# EAGLE design EN715_ExpansionBoard_ver1_0 (EAGLE 9.6.2)
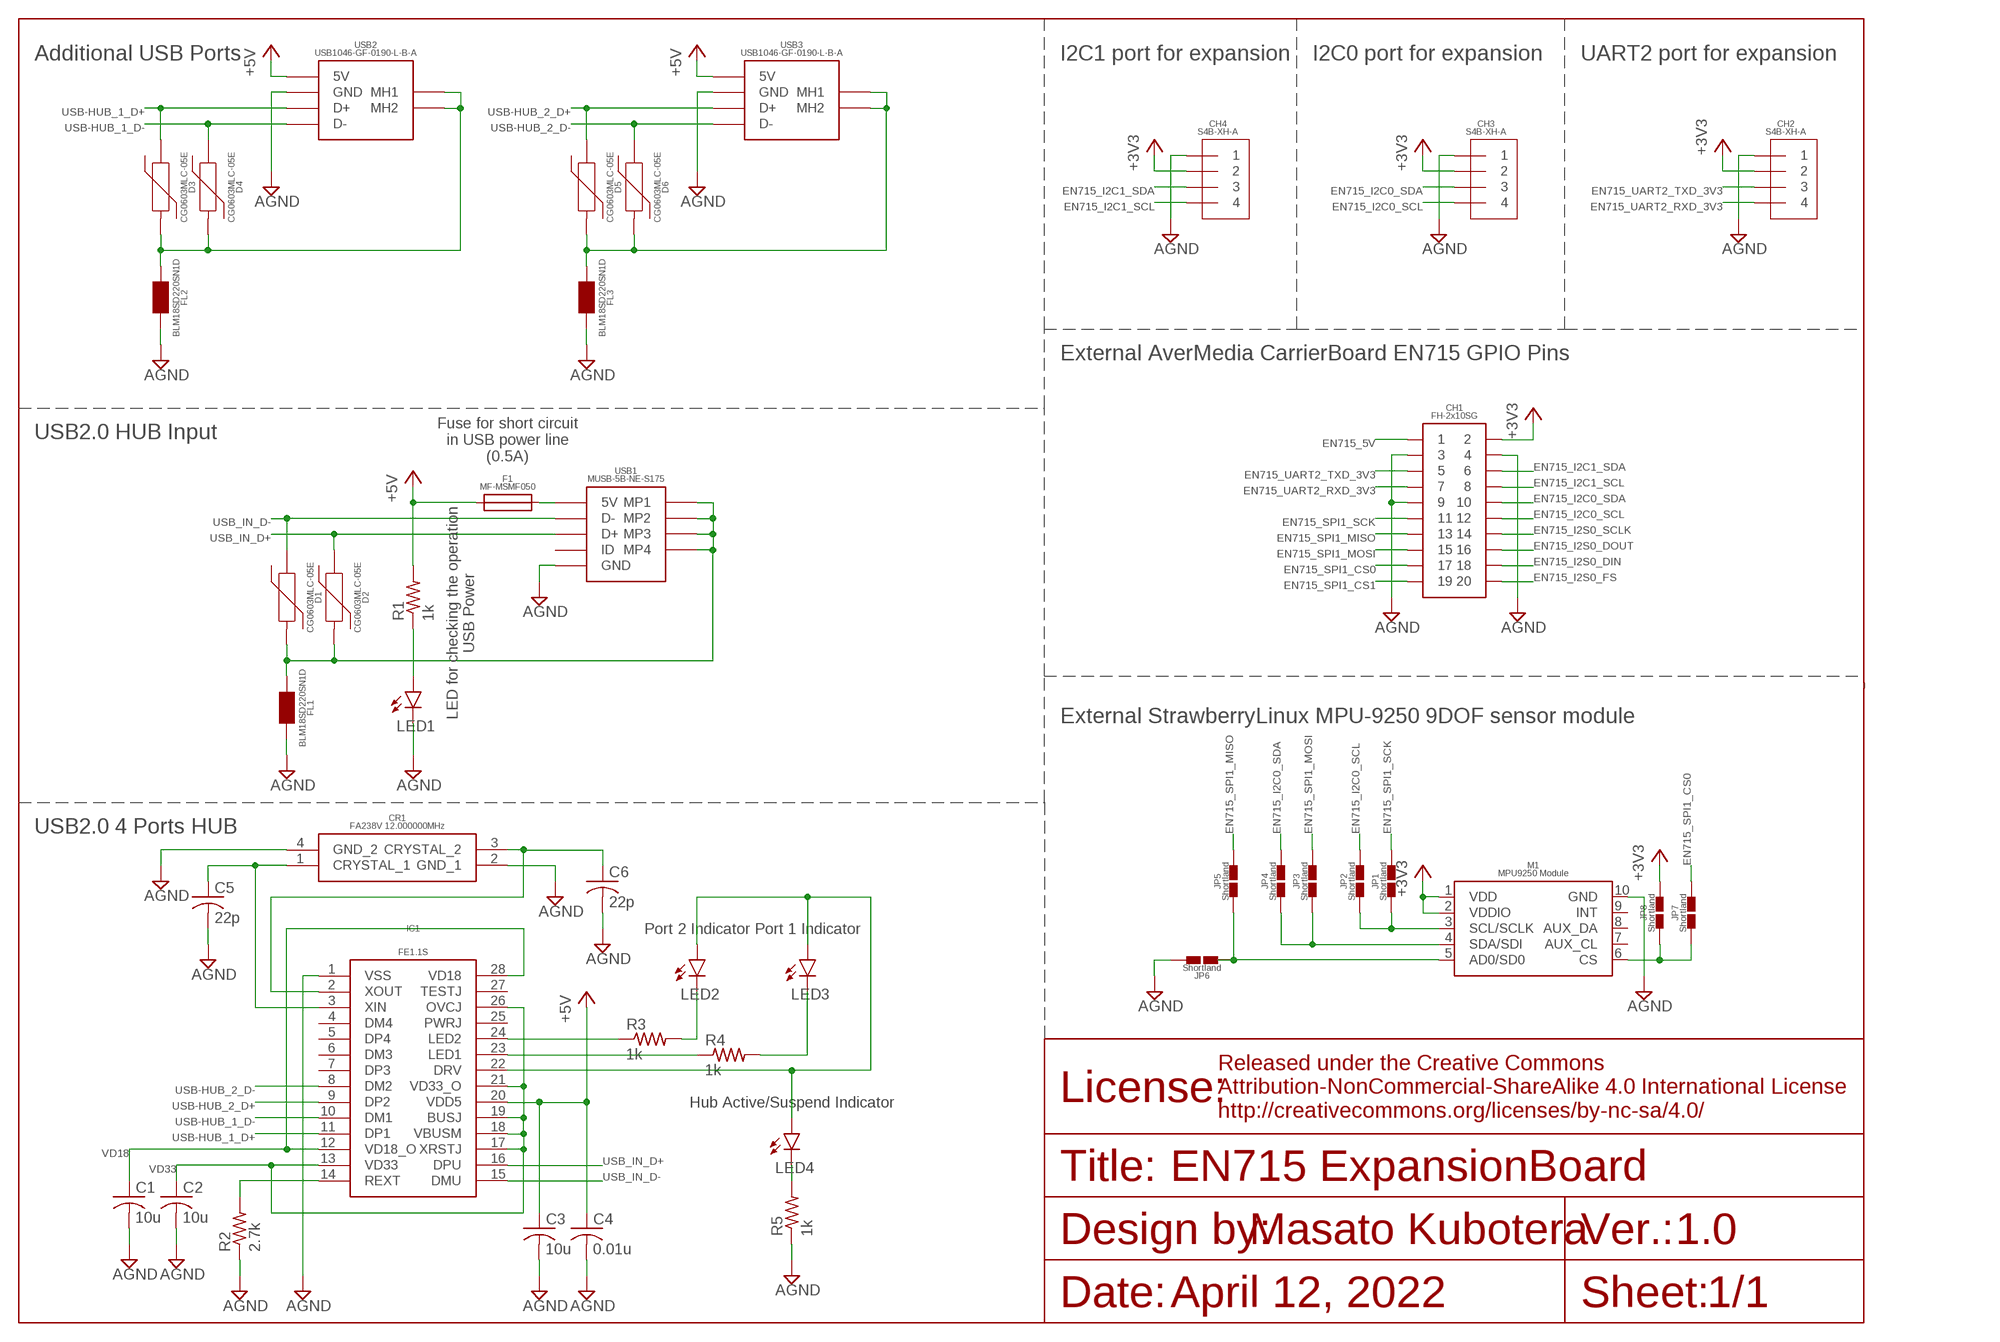
[diagram p0: schematic, sheet 1]

## Parts
C1  10u  C-USC0603  [C0603]
C2  10u  C-USC0603  [C0603]
C3  10u  C-USC0603  [C0603]
C4  0.01u  C-USC0603  [C0603]
C5  22p  C-USC0603  [C0603]
C6  22p  C-USC0603  [C0603]
CH1  2X10  [2X10]
CH2  S4B-XH-A  [S4B-XH-A]
CH3  S4B-XH-A  [S4B-XH-A]
CH4  S4B-XH-A  [S4B-XH-A]
CR1  FA238V_12.000000MHZ  [FA238V]
D1  CG0603MLC-05E  [CG0603MLC-05E]
D2  CG0603MLC-05E  [CG0603MLC-05E]
D3  CG0603MLC-05E  [CG0603MLC-05E]
D4  CG0603MLC-05E  [CG0603MLC-05E]
D5  CG0603MLC-05E  [CG0603MLC-05E]
D6  CG0603MLC-05E  [CG0603MLC-05E]
F1  MF-MSMF050  [MF-MSMF050]
FL1  BLM18SD220SN1D  [BLM18SD220SN1D]
FL2  BLM18SD220SN1D  [BLM18SD220SN1D]
FL3  BLM18SD220SN1D  [BLM18SD220SN1D]
IC1  FE1.1S  [FE1.1S]
JP1  SHORTLAND  [SHORTLAND]
JP2  SHORTLAND  [SHORTLAND]
JP3  SHORTLAND  [SHORTLAND]
JP4  SHORTLAND  [SHORTLAND]
JP5  SHORTLAND  [SHORTLAND]
JP6  SHORTLAND  [SHORTLAND]
JP7  SHORTLAND  [SHORTLAND]
JP8  SHORTLAND  [SHORTLAND]
LED1  LEDSML0603  [SML0603]
LED2  LEDSML0603  [SML0603]
LED3  LEDSML0603  [SML0603]
LED4  LEDSML0603  [SML0603]
M1  MPU9250_MODULE  [MPU9250_MODULE]
R1  1k  R-US_R0603  [R0603]
R2  2.7k  R-US_R0603  [R0603]
R3  1k  R-US_R0603  [R0603]
R4  1k  R-US_R0603  [R0603]
R5  1k  R-US_R0603  [R0603]
USB1  MINI_USB_B_SMD  [MINI_USB_B_SMD]
USB2  USB_A_X1_SMD  [USB_A_X1_SMD]
USB3  USB_A_X1_SMD  [USB_A_X1_SMD]

## Nets
+3V3 [USB-Power]: CH1.2 CH2.2 CH3.2 CH4.2 JP8.2 M1.1(VDD) M1.2(VDDIO)
+5V [USB-Power]: C3.1 C4.1 F1.1 IC1.20(VDD5) R1.2 USB2.1(5V) USB3.1(5V)
AGND [USB-Power]: C1.2 C2.2 C3.2 C4.2 C5.2 C6.2 CH1.3 CH1.4 CH1.9 CH2.1 CH3.1 CH4.1 CR1.2(GND_1) CR1.4(GND_2) FL1.2 FL2.2 FL3.2 IC1.1(VSS) JP6.2 LED1.C M1.10(GND) R2.1 R5.1 USB1.5(GND) USB2.4(GND) USB3.4(GND)
B_FUSE_USB_MINI_B [USB-Power]: F1.2 USB1.1(5V)
EN715_5V [USB-Power]: CH1.1
EN715_I2C0_SCL [USB-Data]: CH1.12 CH3.4 JP2.2
EN715_I2C0_SDA [USB-Data]: CH1.10 CH3.3 JP4.2
EN715_I2C1_SCL [USB-Data]: CH1.8 CH4.4
EN715_I2C1_SDA [USB-Data]: CH1.6 CH4.3
EN715_I2S0_DIN [USB-Data]: CH1.18
EN715_I2S0_DOUT [USB-Data]: CH1.16
EN715_I2S0_FS [USB-Data]: CH1.20
EN715_I2S0_SCLK [USB-Data]: CH1.14
EN715_SPI1_CS0 [USB-Data]: CH1.17 JP7.2
EN715_SPI1_CS1 [USB-Data]: CH1.19
EN715_SPI1_MISO [USB-Data]: CH1.13 JP5.2
EN715_SPI1_MOSI [USB-Data]: CH1.15 JP3.2
EN715_SPI1_SCK [USB-Data]: CH1.11 JP1.2
EN715_UART2_RXD_3V3 [USB-Data]: CH1.7 CH2.4
EN715_UART2_TXD_3V3 [USB-Data]: CH1.5 CH2.3
FE1.1S_DRV [USB-Power]: IC1.22(DRV) LED2.A LED3.A LED4.A
FE1.1S_DRV_LED_A [USB-Power]: LED4.C R5.2
FE1.1S_LED1_A [USB-Power]: LED3.C R4.2
FE1.1S_LED_1_B [USB-Power]: IC1.23(LED1) R4.1
FE1.1S_LED_2_A [USB-Power]: LED2.C R3.2
FE1.1S_LED_2_B [USB-Power]: IC1.24(LED2) R3.1
LED_USBIN [USB-Power]: LED1.A R1.1
MPU9250_AD0/SD0: JP5.1 JP6.1 M1.5(AD0/SD0)
MPU9250_CS: JP7.1 JP8.1 M1.6(CS)
MPU9250_SCL/SCLK: JP1.1 JP2.1 M1.3(SCL/SCLK)
MPU9250_SDA/SDI: JP3.1 JP4.1 M1.4(SDA/SDI)
REXT_FE1.1S [USB-Data]: IC1.14(REXT) R2.2
USB-HUB_1_D+ [USB-Data]: D3.1 IC1.11(DP1) USB2.3(D+)
USB-HUB_1_D- [USB-Data]: D4.1 IC1.10(DM1) USB2.2(D-)
USB-HUB_2_D+ [USB-Data]: D5.1 IC1.9(DP2) USB3.3(D+)
USB-HUB_2_D- [USB-Data]: D6.1 IC1.8(DM2) USB3.2(D-)
USB_A_1_SHIELD [USB-Power]: D3.2 D4.2 FL2.1 USB2.MH1 USB2.MH2
USB_A_2_SHIELD [USB-Power]: D5.2 D6.2 FL3.1 USB3.MH1 USB3.MH2
USB_IN_D+ [USB-Data]: D2.1 IC1.16(DPU) USB1.3(D+)
USB_IN_D- [USB-Data]: D1.1 IC1.15(DMU) USB1.2(D-)
USB_MINI_B_SHIELD [USB-Power]: D1.2 D2.2 FL1.1 USB1.MP1 USB1.MP2 USB1.MP3 USB1.MP4
VD18 [USB-Power]: C1.1 IC1.12(VD18_O) IC1.28(VD18)
VD33 [USB-Power]: C2.1 IC1.13(VD33) IC1.17(XRSTJ) IC1.18(VBUSM) IC1.19(BUSJ) IC1.21(VD33_O) IC1.26(OVCJ)
XIN_FE1.1S [USB-Data]: C5.1 CR1.1(CRYSTAL_1) IC1.3(XIN)
XOUT_FE1.1S [USB-Data]: C6.1 CR1.3(CRYSTAL_2) IC1.2(XOUT)
Unconnected: IC1.4(DM4) IC1.5(DP4) IC1.6(DM3) IC1.7(DP3) IC1.25(PWRJ) IC1.27(TESTJ) M1.7(AUX_CL) M1.8(AUX_DA) M1.9(INT) USB1.4(ID)

## Notes on the sheet
- Additional USB Ports | I2C1 port for expansion | I2C0 port for expansion | UART2 port for expansion
- External AverMedia CarrierBoard EN715 GPIO Pins
- USB2.0 HUB Input
- Fuse for short circuit
  in USB power line
  (0.5A)
- LED for checking the operation
  USB Power
- External StrawberryLinux MPU-9250 9DOF sensor module
- USB2.0 4 Ports HUB
- Port 2 Indicator | Port 1 Indicator
- Hub Active/Suspend Indicator
- EN715 ExpansionBoard
- 1.0
- April 12, 2022 | 1/1

## Library data of the parts
C1-C6 = rcl:C-US: CAPACITOR, American symbol; SPICEPREFIX: C
CH1 = Pin_socket:2X10
CH2-CH4 = JST-XH:S4B-XH-A
CR1 = FA238V:FA238V_12.000000MHZ
D1-D6 = CG0603MLC-05E:CG0603MLC-05E
F1 = MF-MSMF:MF-MSMF050
FL1-FL3 = BLM18SD220SN1D:BLM18SD220SN1D
IC1 = FE1.1S:FE1.1S
JP1-JP8 = Shortland:SHORTLAND
LED1-LED4 = led:LED: LED OSRAM: - CHIPLED LG R971, LG N971, LY N971, LG Q971, LY Q971, LO R971, LY R971 LH N974, LH R974 LS Q976, LO Q976, LY Q976 LO Q996 - Hyper CHIPLED LW Q18S LB Q993, LB Q99A, LB R99A - SideLED LS A670, LO A670, LY A670, LG A670, LP A670 LB A673, LV A673, LT A673, LW A673 LH A674 LY A675 LS A676, LA A676, LO A676, LY A676, LW A676 LS A679, LY A679, LG A679 - Hyper Micro SIDELED® LS Y876, LA Y876, LO Y876, LY Y876 LT Y87S - SmartLED LW L88C, LW L88S LB L89C, LB L89S, LG L890 LS L89K, LO L89K, LY L89K LS L896, LA L896, LO L896, LY L896 - TOPLED LS T670, LO T670, LY T670, LG T670, LP T670 LSG T670, LSP T670, LSY T670, LOP T670, LYG T670 LG T671, LOG T671, LSG T671 LB T673, LV T673, LT T673, LW T673 LH T674 LS T676, LA T676, LO T676, LY T676, LB T676, LH T676, LSB T676, LW T676 LB T67C, LV T67C, LT T67C, LS T67K, LO T67K, LY T67K, LW E67C LS E67B, LA E67B, LO E67B, LY E67B, LB E67C, LV E67C, LT E67C LW T67C LS T679, LY T679, LG T679 LS T770, LO T770, LY T770, LG T770, LP T770 LB T773, LV T773, LT T773, LW T773 LH T774 LS E675, LA E675, LY E675, LS T675 LS T776, LA T776, LO T776, LY T776, LB T776 LHGB T686 LT T68C, LB T68C - Hyper Mini TOPLED® LB M676 - Mini TOPLED Santana® LG M470 LS M47K, LO M47K, LY M47K Source: http://www.osram.convergy.de LUXEON: - LUMILED® LXK2-PW12-R00, LXK2-PW12-S00, LXK2-PW14-U00, LXK2-PW14-V00 LXK2-PM12-R00, LXK2-PM12-S00, LXK2-PM14-U00 LXK2-PE12-Q00, LXK2-PE12-R00, LXK2-PE12-S00, LXK2-PE14-T00, LXK2-PE14-U00 LXK2-PB12-K00, LXK2-PB12-L00, LXK2-PB12-M00, LXK2-PB14-N00, LXK2-PB14-P00, LXK2-PB14-Q00 LXK2-PR12-L00, LXK2-PR12-M00, LXK2-PR14-Q00, LXK2-PR14-R00 LXK2-PD12-Q00, LXK2-PD12-R00, LXK2-PD12-S00 LXK2-PH12-R00, LXK2-PH12-S00 LXK2-PL12-P00, LXK2-PL12-Q00, LXK2-PL12-R00 Source: www.luxeon.com KINGBRIGHT: KA-3528ASYC Source: www.kingbright.com
M1 = Strawberry-Linux_MPUP250_Module:MPU9250_MODULE
R1-R5 = rcl:R-US_: RESISTOR, American symbol; SPICEPREFIX: R
USB1 = USB_Connector:MINI_USB_B_SMD
USB2 USB3 = USB_Connector:USB_A_X1_SMD

## Net classes
1 USB-Data: width 0.203 mm, drill 0.127 mm, clearance 0.203 mm
2 USB-Power: width 0.254 mm, drill 0.127 mm, clearance 0.203 mm

## Board
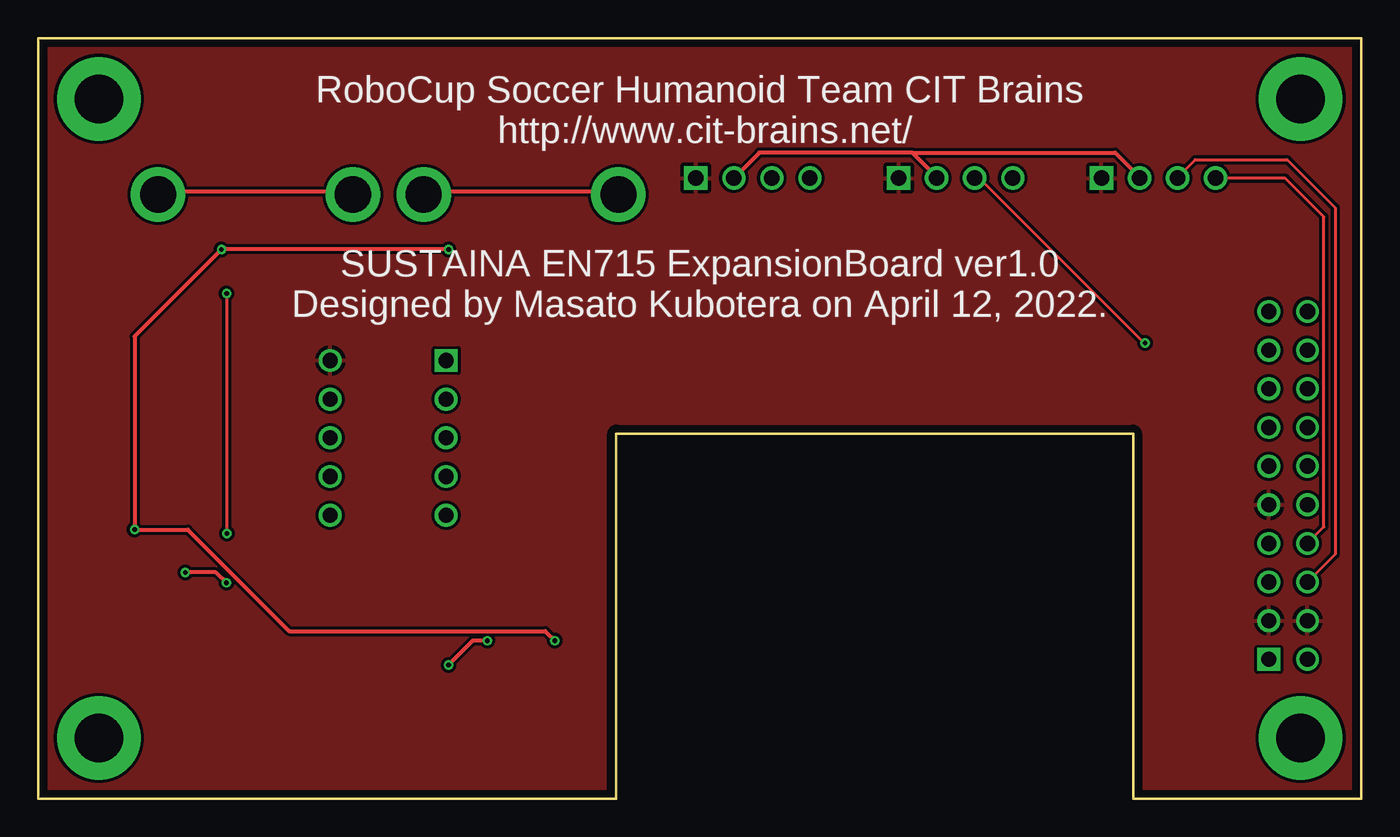
[diagram p1: board, top side]
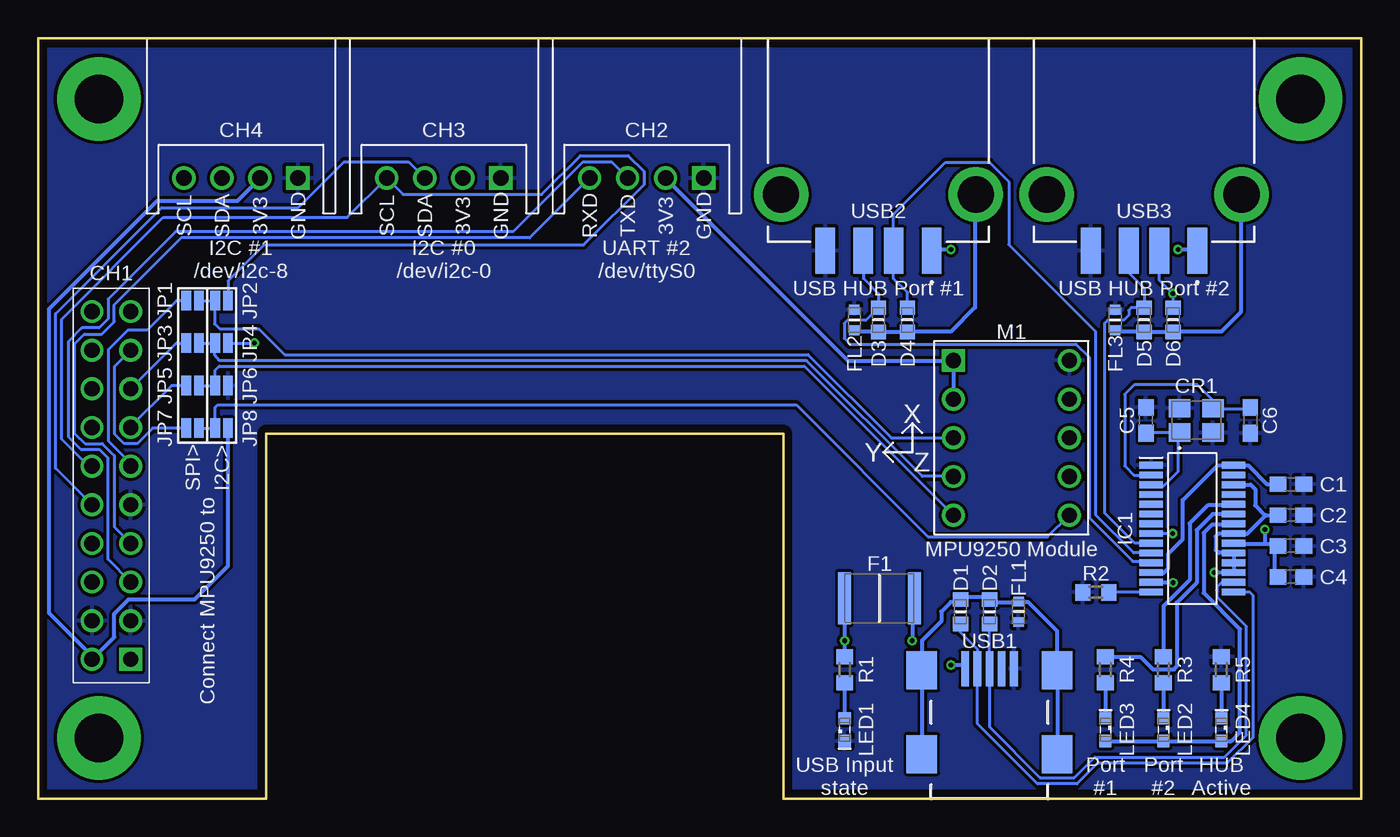
[diagram p2: board, bottom side, seen from below]

Size 87 x 50 mm. Coordinates in mm from the lower left corner, seen from the top.
Outline: 0,50 0,0 38,0 38,24 72,24 72,0 87,0 87,50 0,50
Copper layers (1*16): Top 0.035mm / dielectric 1.6mm / Bottom 0.035mm
Design rules "Elecrow_2-layer_PCB_eagle_rule": minimum track width 6mil, minimum drill 12mil, track to track 6mil, track to pad 6mil, pad to pad 6mil, via to via 8mil, smd to smd 0mil, copper to edge 20mil, drill to drill 10mil, minimum pad ring 6mil, minimum via ring 6mil, stop-mask expansion 0mil, vias tented up to drill 100mil, thermal gap 10mil

### Footprints (pad centres in the part's own frame; a part is rotated, then mirrored left to right if it is on the bottom)
C0603 = smd 1.1 x 1: 1 -0.85,0; 2 0.85,0
2X10 = drill 1 pad 1.5 square: 1 -11.43,-1.27 | drill 1 pad 1.5: 2 -11.43,1.27; 3 -8.89,-1.27; 4 -8.89,1.27; 5 -6.35,-1.27; 6 -6.35,1.27; 7 -3.81,-1.27; 8 -3.81,1.27; 9 -1.27,-1.27; 10 -1.27,1.27; 11 1.27,-1.27; 12 1.27,1.27; 13 3.81,-1.27; 14 3.81,1.27; 15 6.35,-1.27; 16 6.35,1.27; 17 8.89,-1.27; 18 8.89,1.27; 19 11.43,-1.27; 20 11.43,1.27
S4B-XH-A = drill 1.016 square: 1 3.75,0 | drill 1.016: 2 1.25,0; 3 -1.25,0; 4 -3.75,0
FA238V = smd 1.4 x 1.2: 1 -1.1,-0.8; 2 1.1,-0.8; 3 1.1,0.8; 4 -1.1,0.8
CG0603MLC-05E = smd 0.95 x 1: 1 -0.8,0; 2 0.8,0
MF-MSMF050 = smd 0.85 x 3.43: 1 -2.3,0; 2 2.3,0
BLM18SD220SN1D = smd 0.65 x 0.7: 1 -0.675,0; 2 0.675,0
FE1.1S = smd 1.525 x 0.44: 1 -2.712,4.16; 2 -2.712,3.52; 3 -2.712,2.88; 4 -2.712,2.24; 5 -2.712,1.6; 6 -2.712,0.96; 7 -2.712,0.32; 8 -2.712,-0.32; 9 -2.712,-0.96; 10 -2.712,-1.6; 11 -2.712,-2.24; 12 -2.712,-2.88; 13 -2.712,-3.52; 14 -2.712,-4.16; 15 2.712,-4.16; 16 2.712,-3.52; 17 2.712,-2.88; 18 2.712,-2.24; 19 2.712,-1.6; 20 2.712,-0.96; 21 2.712,-0.32; 22 2.712,0.32; 23 2.712,0.96; 24 2.712,1.6; 25 2.712,2.24; 26 2.712,2.88; 27 2.712,3.52; 28 2.712,4.16
SHORTLAND = smd 0.635 x 1.27: 1 -0.419,0; 2 0.419,0
SML0603 = smd 0.8 x 0.8: A 0.75,0; C -0.75,0
MPU9250_MODULE = drill 1 square: 1 -5.08,-3.81 | drill 1: 2 -2.54,-3.81; 3 0,-3.81; 4 2.54,-3.81; 5 5.08,-3.81; 6 5.08,3.81; 7 2.54,3.81; 8 0,3.81; 9 -2.54,3.81; 10 -5.08,3.81
R0603 = smd 1 x 1.1: 1 -0.85,0; 2 0.85,0
MINI_USB_B_SMD = smd 0.5 x 2.3: 1 -1.6,8.55; 2 -0.8,8.55; 3 0,8.55; 4 0.8,8.55; 5 1.6,8.55 | smd 2 x 2.5: MP1 -4.45,8.45; MP2 4.45,8.45; MP3 4.45,2.95; MP4 -4.45,2.95
USB_A_X1_SMD = smd 1.3 x 3: 1 -3.5,13.98; 2 -1,13.98; 3 1,13.98; 4 3.5,13.98 | drill 2.38 pad 3.57: MH1 -6.4,10.28; MH2 6.4,10.28

### Placement (x,y rotation side)
C1  4.64,20.68 0 bottom
C2  4.64,18.65 0 bottom
C3  4.64,16.62 0 bottom
C4  4.64,14.59 0 bottom
C5  14.16,24.87 90 bottom
C6  7.3,24.87 270 bottom
CH1  82.18,20.6 90 bottom
CH2  46.99,40.8 0 bottom
CH3  60.33,40.8 0 bottom
CH4  73.66,40.8 0 bottom
CR1  10.86,24.87 0 bottom
D1  26.36,12.3 90 bottom
D2  24.45,12.3 90 bottom
D3  31.75,31.48 270 bottom
D4  29.85,31.48 270 bottom
D5  14.29,31.48 270 bottom
D6  12.39,31.48 270 bottom
F1  31.69,13.19 0 bottom
FL1  22.55,12.3 270 bottom
FL2  33.34,31.48 90 bottom
FL3  16.2,31.48 90 bottom
IC1  11.12,17.76 0 bottom
JP1  76.84,32.75 180 bottom
JP2  74.93,32.75 0 bottom
JP3  76.84,29.95 180 bottom
JP4  74.93,29.95 0 bottom
JP5  76.84,27.16 180 bottom
JP6  74.93,27.16 0 bottom
JP7  76.84,24.36 180 bottom
JP8  74.93,24.36 0 bottom
LED1  33.98,4.55 90 bottom
LED2  13.02,4.55 270 bottom
LED3  16.83,4.55 270 bottom
LED4  9.21,4.55 270 bottom
M1  23.02,23.73 270 bottom
R1  33.98,8.49 90 bottom
R2  17.46,13.57 0 bottom
R3  13.02,8.49 270 bottom
R4  16.83,8.49 270 bottom
R5  9.21,8.49 270 bottom
USB1  24.45,0 0 bottom
USB2  31.75,50 180 bottom
USB3  14.29,50 180 bottom

### Tracks (layer width: path | path; a pad name or v marks a point on that pad's centre or on a via)
+3V3
  Top 0.254: 26.99,28.81 M1.1 | 57.47,42.46 47.41,42.46 45.75,40.8 CH2.2 | 57.47,42.46 59.06,40.88 CH3.2 | 57.47,42.46 70.81,42.46 72.39,40.88 CH4.2
  Bottom 0.254: CH4.2 73.92,39.29 79.19,39.29 86.29,32.19 86.29,12.22 83.5,9.44 CH1.2 81.99,10.63 81.99,12.16 81.04,13.11 76.72,13.11 74.53,15.3 74.53,24.35 JP8.2 | CH2.2 33.76,28.81 M1.1 M1.2
+5V  (via drill 0.3)
  Top 0.254: v26.99,36.11 v12.07,36.11 6.35,30.4 v6.35,17.7 9.84,17.7 16.51,11.03 33.34,11.03 v33.98,10.39
  Bottom 0.254: R1.2 v33.98,10.39 33.98,12.94 F1.1 | C4.1 5.72,14.84 5.72,16.43 C3.1 5.72,16.74 6.35,16.74 | 6.35,16.74 8.26,16.74 IC1.20 | v12.07,36.11 10.8,36.11 USB3.1 | v26.99,36.11 27.94,36.11 USB2.1 | v6.35,17.7 6.35,16.74
AGND
  pour Top: -0.95,51.03 -0.95,-1.04 38.42,-1.04 38.42,23.09 71.44,23.09 71.44,-1.04 87.95,-1.04 87.95,51.03
  pour Bottom: -1.59,51.67 -1.59,-1.67 39.05,-1.67 39.05,22.46 70.81,22.46 70.81,-1.67 88.59,-1.67 88.59,51.67
B_FUSE_USB_MINI_B  (via drill 0.3)
  Top 0.254: v26.99,8.81 28.58,10.39 v29.53,10.39
  Bottom 0.254: v26.99,8.81 26.04,8.81 USB1.1 | v29.53,10.39 29.53,12.94 F1.2
EN715_I2C0_SCL
  Bottom 0.203: CH1.12 83.68,21.87 85.44,23.63 85.44,31.54 78.76,38.21 66.67,38.21 CH3.4 63.01,39.73 53.89,39.73 51.35,42.27 48.21,42.27 47.18,41.24 47.18,40.36 51.13,36.41 72.15,36.41 74.51,34.04 JP2.2
EN715_I2C0_SDA  (via drill 0.3)
  Top 0.203: CH3.3 61.89,40.8 72.74,29.95 v72.77,29.95
  Bottom 0.203: CH1.10 85.84,21.72 85.84,31.89 78.88,38.86 69.9,38.86 66.89,41.87 62.64,41.87 CH3.3 | JP4.2 v72.77,29.95
EN715_I2C1_SCL
  Top 0.203: CH4.4 81.98,40.8 84.53,38.25 84.53,17.87 CH1.8
EN715_I2C1_SDA
  Top 0.203: CH4.3 74.91,40.86 76.07,42.02 82.11,42.02 85.27,38.85 85.27,16.07 CH1.6
EN715_SPI1_CS0
  Bottom 0.203: CH1.17 81.97,28.43 81.97,23.97 81.35,23.36 80.47,23.36 79.46,24.36 JP7.2
EN715_SPI1_MISO
  Bottom 0.203: JP5.2 78.23,27.16 80.91,24.48 CH1.13
EN715_SPI1_MOSI
  Bottom 0.203: CH1.15 77.91,29.95 JP3.2
EN715_SPI1_SCK
  Bottom 0.203: JP1.2 77.89,32.75 79.84,30.8 81.09,30.8 82.37,29.52 82.37,23.52 80.91,22.06 CH1.11
EN715_UART2_RXD_3V3
  Bottom 0.203: CH2.4 54.68,36.87 77.6,36.87 81.99,32.48 81.99,31.36 82.81,30.55 83.95,30.55 84.6,29.89 84.6,24.04 83.91,23.34 82.77,23.34 81.99,22.56 81.99,17.87 CH1.7
EN715_UART2_TXD_3V3
  Bottom 0.203: CH2.3 48.24,40.83 49.28,41.87 51.18,41.87 55.77,37.28 77.95,37.28 82.4,32.84 82.4,31.54 82.99,30.95 84.12,30.95 85.01,30.05 85.01,23.8 84.16,22.94 82.94,22.94 82.4,22.4 82.4,15.73 CH1.5
FE1.1S_DRV
  Bottom 0.254: LED3.A LED2.A LED4.A 8.56,3.8 7.99,4.38 7.99,11.16 10.38,13.54 10.38,17.48 9.84,18.02 8.58,18.02 IC1.22
FE1.1S_DRV_LED_A
  Bottom 0.254: R5.2 LED4.C
FE1.1S_LED1_A
  Bottom 0.254: R4.2 LED3.C
FE1.1S_LED_1_B
  Bottom 0.254: 8.58,18.65 IC1.23 9.79,18.72 10.84,17.67 10.84,14.21 12.14,12.91 12.14,8.7 12.33,8.51 13.71,8.51 14.54,9.34 R4.1
FE1.1S_LED_2_A
  Bottom 0.254: R3.2 LED2.C
FE1.1S_LED_2_B
  Bottom 0.254: IC1.24 8.48,19.29 10.11,19.29 11.29,18.1 11.29,14.4 13.02,12.67 R3.1
LED_USBIN
  Bottom 0.254: R1.1 LED1.A
MPU9250_AD0/SD0
  Bottom 0.203: JP5.1 JP6.1 75.35,28.18 75.09,28.44 36.62,28.44 M1.5
MPU9250_CS
  Bottom 0.203: JP7.1 JP8.1 75.35,25.72 75.19,25.89 37.15,25.89 28.49,17.23 20.64,17.23 M1.6
MPU9250_SCL/SCLK
  Bottom 0.203: JP1.1 JP2.1 75.39,32.71 75.39,31.22 75.06,30.89 72.48,30.89 70.79,29.2 36.37,29.2 30.9,23.73 M1.3
MPU9250_SDA/SDI
  Bottom 0.203: JP3.1 75.39,29.95 | 75.39,29.95 JP4.1 | M1.4 28.86,21.19 36.48,28.81 75.08,28.81 75.39,29.16 75.39,29.95
REXT_FE1.1S
  Bottom 0.203: R2.2 13.97,13.57 IC1.14
S$1  (via drill 3.2 pad 5.5)
  other vias: 4,46
S$2  (via drill 3.2 pad 5.5)
  other vias: 83,46
S$3  (via drill 3.2 pad 5.5)
  other vias: 83,4
S$4  (via drill 3.2 pad 5.5)
  other vias: 4,4
USB-HUB_1_D+
  Bottom 0.203: 32.7,35.8 USB2.3 32.75,34.2 31.75,33.2 D3.1 32.58,31.45 33.8,31.45 34,31.25 34,30.26 33.63,29.89 18.76,29.89 17.9,29.02 17.9,18.47 15.04,15.61 14.11,15.61 | 13.97,15.47 IC1.11
  Bottom 0.254: 14.11,15.61 13.97,15.47
USB-HUB_1_D-
  Bottom 0.203: 13.97,16.11 IC1.10 14.98,16.16 17.46,18.65 17.46,30.71 23.18,36.43 23.18,40.56 24.45,41.83 27.35,41.83 30.75,38.42 USB2.2 30.75,34.2 29.85,33.29 D4.1
USB-HUB_2_D+
  Bottom 0.203: USB3.3 15.24,35.8 15.24,34.52 14.29,33.57 D5.1 15.14,32.28 15.31,32.11 15.31,31.77 15.62,31.46 16.68,31.46 16.88,31.26 16.88,18.79 14.89,16.8 IC1.9
  Bottom 0.254: IC1.9 13.92,16.89
USB-HUB_2_D-  (via drill 0.3)
  Top 0.203: v12.4,33.2 12.4,17.46 v12.41,17.44
  Bottom 0.203: D6.1 v12.4,33.2 13.29,34.09 USB3.2 | v12.41,17.44 IC1.8
USB_A_1_SHIELD
  Top 0.254: USB2.MH2 38.1,39.92 25.4,39.92 USB2.MH1
  Bottom 0.254: 31.75,30.71 33.34,30.71 FL2.1 | 31.75,30.71 29.85,30.71 | 31.75,30.71 D3.2 | 29.85,30.71 26.99,30.71 25.4,32.3 25.4,39.61 USB2.MH1 | 29.85,30.71 D4.2
USB_A_2_SHIELD
  Top 0.254: USB3.MH2 20.64,39.92 7.94,39.92 USB3.MH1
  Bottom 0.254: 14.29,30.71 16.2,30.71 FL3.1 | 14.29,30.71 12.39,30.71 | 14.29,30.71 D5.2 | 12.39,30.71 9.21,30.71 7.94,31.98 7.94,39.61 USB3.MH1 | 12.39,30.71 D6.2
USB_IN_D+
  Bottom 0.203: D2.1 USB1.3 24.46,4.73 21.13,1.39 18.87,1.39 17.52,2.75 9.01,2.75 7.56,4.2 7.56,11.34 9.47,13.26 9.47,13.63 9.54,13.7 9.47,13.77 9.47,13.95 9.18,14.24 IC1.16 8.26,14.21
USB_IN_D-
  Bottom 0.203: D1.1 26.36,10.94 25.26,9.84 USB1.2 | USB1.2 | 8.58,13.57 IC1.15 7.36,13.6 7.15,13.39 7.15,4.03 8.84,2.34 17.35,2.34 18.7,0.99 21.3,0.99 25.26,4.95 USB1.2
USB_MINI_B_SHIELD
  Bottom 0.254: USB1.MP4 28.89,3.09 28.89,8.17 USB1.MP1 28.89,8.49 28.89,10.39 27.62,11.66 27.62,12.3 26.99,12.94 26.36,12.94 D1.2 26.36,13.25 24.45,13.25 D2.2 24.45,12.94 22.55,12.94 | 22.55,12.94 21.91,12.94 20,11.03 20,8.49 USB1.MP2 20,8.17 20,3.09 USB1.MP3 | 22.55,12.94 FL1.1
VD18
  Bottom 0.254: 5.72,20.87 C1.1 6.21,20.68 7.45,21.92 IC1.28 9.46,21.92 11.75,19.63 11.75,17.06 12.7,16.11 12.7,15.16 13.02,14.84 13.66,14.84 IC1.12
VD33  (via drill 0.3)
  Top 0.254: v9.68,14.88 11.69,14.88 v12.39,14.21
  Bottom 0.254: 8.58,14.84 IC1.17 | v12.39,14.21 13.66,14.21 IC1.13 | 8.26,16.11 IC1.19 | 8.58,17.38 IC1.21 | 8.58,15.47 IC1.18 | IC1.19 IC1.18 | IC1.18 IC1.17 | IC1.17 8.49,14.79 | IC1.19 9.39,16.16 9.59,16.36 9.59,17.25 9.4,17.44 IC1.21 | C2.1 6.3,18.65 6.33,18.62 | IC1.21 7.51,17.44 6.33,18.62 | v9.68,14.88 IC1.17 | IC1.26 8.39,20.65 7.29,20.65 6.99,20.36 6.99,19.29 6.33,18.62
XIN_FE1.1S
  Bottom 0.203: 12.07,24.05 13.97,24.05 C5.1 | 12.07,24.05 12.07,21.51 13.02,20.55 13.66,20.55 IC1.3 | 12.07,24.05 CR1.1
XOUT_FE1.1S
  Bottom 0.203: C6.1 7.3,25.64 9.53,25.64 CR1.3 9.53,25.95 10.8,27.22 14.93,27.22 15.56,26.59 15.56,21.89 14.95,21.28 IC1.2

### Text on the board
tPlace: RoboCup Soccer Humanoid Team CIT Brains / http://www.cit-brains.net/ | SUSTAINA EN715 ExpansionBoard ver1.0 / Designed by Masato Kubotera on April 12, 2022.
bPlace: GND | 3V3 | TXD | RXD | GND | 3V3 | SDA | SCL | GND | 3V3 | SDA | SCL | UART #2 / /dev/ttyS0 | I2C #0 / /dev/i2c-0 | I2C #1 / /dev/i2c-8 | USB HUB Port #2 | USB HUB Port #1 | X | Y | Z | I2C> | Connect MPU9250 to | SPI> | MPU9250 Module | HUB / Active | Port / #2 | Port / #1 | USB Input / state